# EAGLE design WisolWSSFM10R2-Breakout (EAGLE 8.1.1)
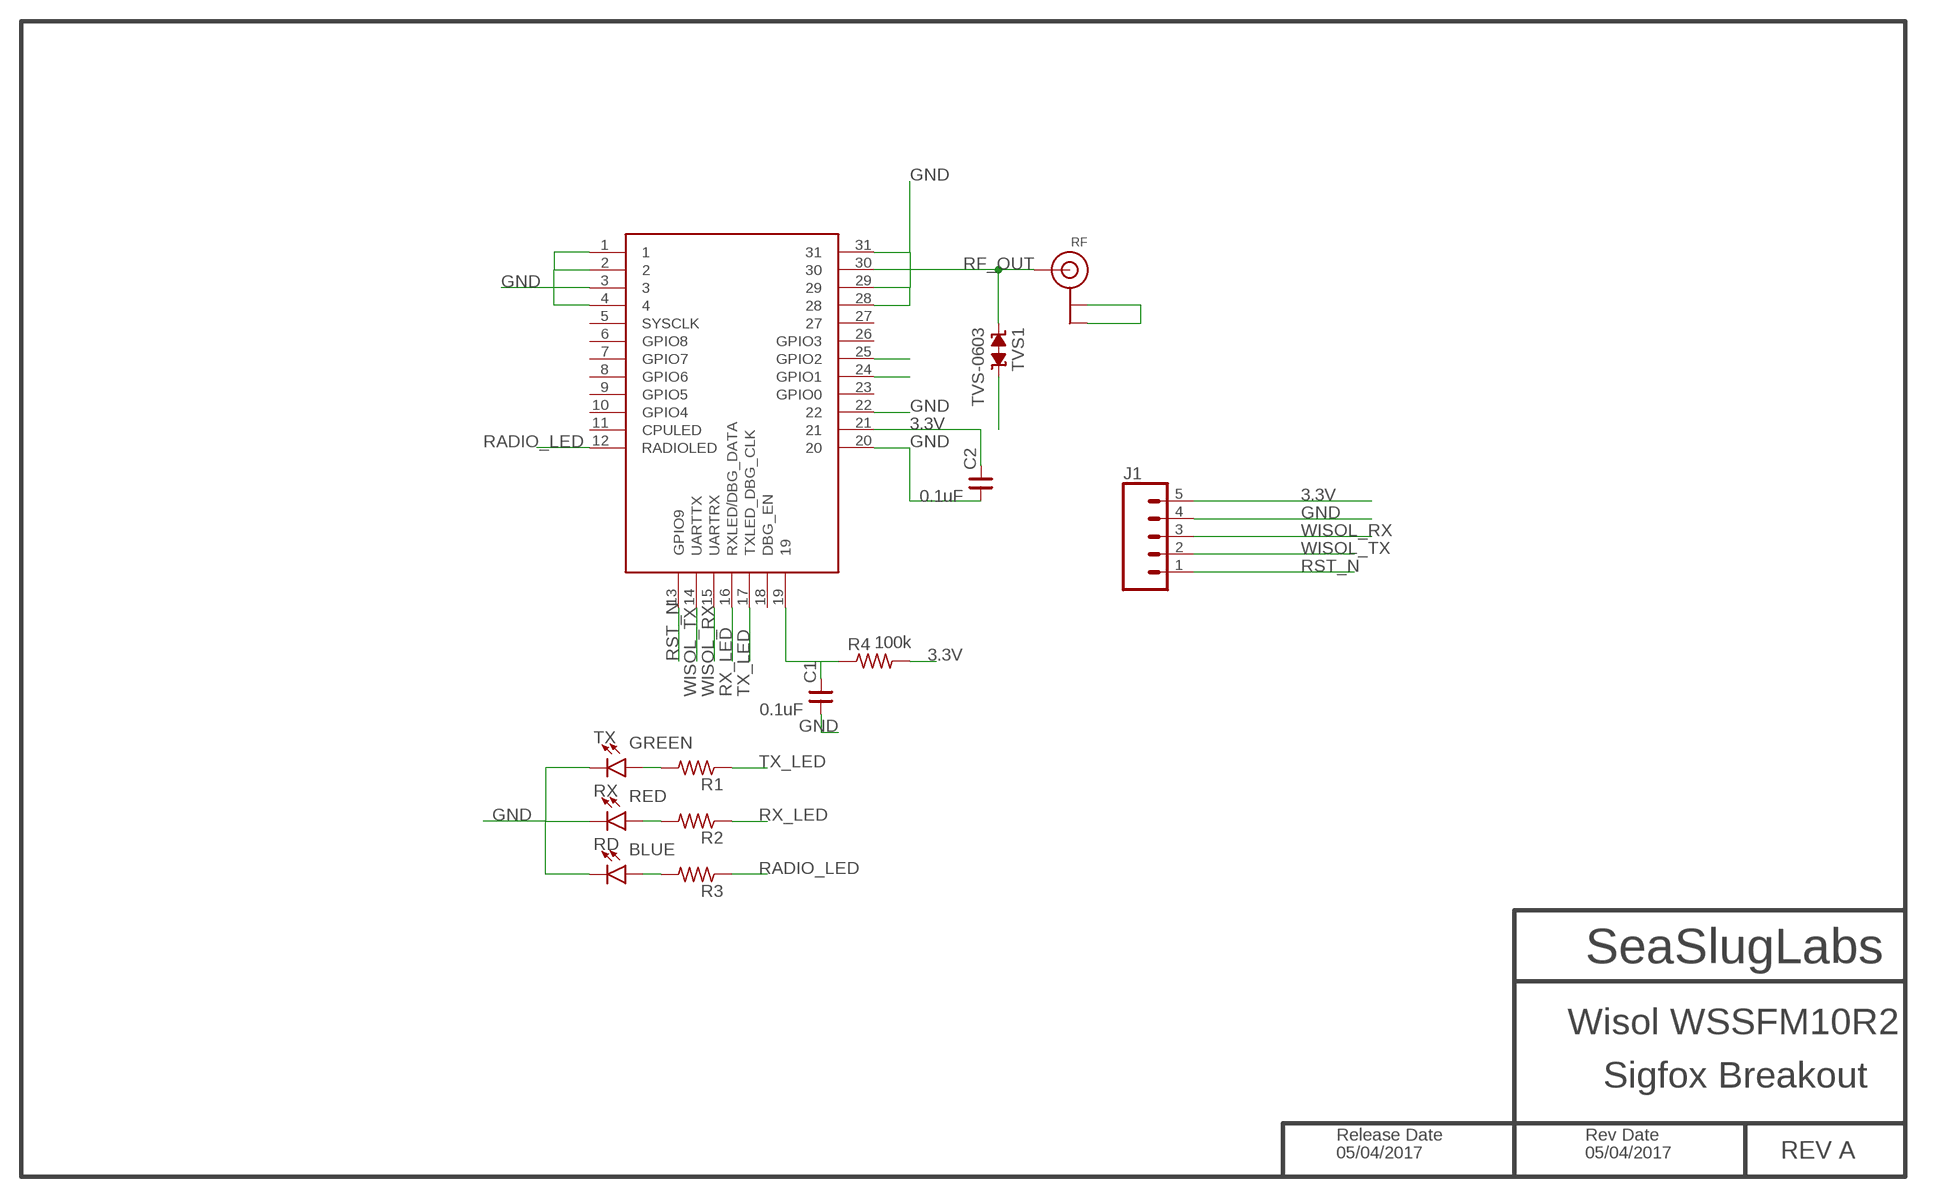
[diagram p0: schematic, sheet 1]

## Parts
C1  0.1uF  CNP-0402  [0402]
C2  0.1uF  CNP-0402  [0402]
J1  CONN_05  [1X05]
R1  R-US_R0402  [R0402]
R2  R-US_R0402  [R0402]
R3  R-US_R0402  [R0402]
R4  100k  R-US_R0402  [R0402]
RD  BLUE  LED-BLUE0603  [LED-0603]
RF  ANTENNA_U.FL  [U.FL]
RX  RED  LED-RED0603  [LED-0603]
TVS1  TVS-0603  [TVS0603]
TX  GREEN  LED-GREEN0603  [LED-0603]
WSSFM10R2  WSSFM10R2/R4WSSFM10R2R4  [WISOL]

## Nets
3.3V: C2.2 J1.5 R4.2 WSSFM10R2.21
GND: C1.1 C2.1 J1.4 RD.C RF.1(GND) RF.2(GND) RX.C TVS1.2 TX.C WSSFM10R2.1 WSSFM10R2.2 WSSFM10R2.3 WSSFM10R2.4 WSSFM10R2.20 WSSFM10R2.22 WSSFM10R2.28 WSSFM10R2.29 WSSFM10R2.31
GPIO1: WSSFM10R2.24(GPIO1)
GPIO2: WSSFM10R2.25(GPIO2)
N$1: C1.2 R4.1 WSSFM10R2.19
N$2: R1.2 TX.A
N$3: R2.2 RX.A
N$4: R3.2 RD.A
RADIO_LED: R3.1 WSSFM10R2.12(RADIOLED)
RF_OUT: RF.3(SIGNAL) TVS1.1 WSSFM10R2.30
RST_N: J1.1 WSSFM10R2.13(GPIO9)
RX_LED: R2.1 WSSFM10R2.16(RXLED/DBG_DATA)
TX_LED: R1.1 WSSFM10R2.17(TXLED_DBG_CLK)
WISOL_RX: J1.3 WSSFM10R2.15(UARTRX)
WISOL_TX: J1.2 WSSFM10R2.14(UARTTX)
Unconnected: WSSFM10R2.5(SYSCLK) WSSFM10R2.6(GPIO8) WSSFM10R2.7(GPIO7) WSSFM10R2.8(GPIO6) WSSFM10R2.9(GPIO5) WSSFM10R2.10(GPIO4) WSSFM10R2.11(CPULED) WSSFM10R2.18(DBG_EN) WSSFM10R2.23(GPIO0) WSSFM10R2.26(GPIO3) WSSFM10R2.27

## Notes on the sheet
- SeaSlugLabs
- Wisol WSSFM10R2
- Sigfox Breakout
- Release Date | Rev Date
- 05/04/2017 | 05/04/2017 | REV A

## Library data of the parts
C1 C2 = IoTthings:CNP-: NON-POLARIZED CAP
J1 = SparkFun-Connectors:CONN_05: Multi connection point. Often used as Generic Header-pin footprint for 0.1 inch spaced/style header connections On any of the 0.1 inch spaced packages, you can populate with these: Break Away Headers - Straight <https://www.sparkfun.com/products/116> (PRT-00116) Break Away Male Headers - Right Angle <https://www.sparkfun.com/products/553> (PRT-00553) Female Headers <https://www.sparkfun.com/products/115> (PRT-00115) Break Away Headers - Machine Pin <https://www.sparkfun.com/products/117> (PRT-00117) Break Away Female Headers - Swiss Machine Pin <https://www.sparkfun.com/products/743> (PRT-00743) For SCREWTERMINALS and SPRING TERMINALS visit here: Screw Terimnals on SparkFun.com <https://www.sparkfun.com/search/results?term=Screw+Terminals> (5mm/3.5mm/2.54mm spacing) This device is also useful as a general connection point to wire up your design to another part of your project. Our various solder wires solder well into these plated through hole pads. Hook-Up Wire - Assortment (Stranded, 22 AWG) <https://www.sparkfun.com/products/11375> (PRT-11375) Hook-Up Wire - Assortment (Solid Core, 22 AWG) <https://www.sparkfun.com/products/11367> (PRT-11367) View the entire wire category on our website here <https://www.sparkfun.com/categories/141> Special notes: Molex polarized connector foot print use with SKU : PRT-08231 with associated crimp pins and housings. 1MM SMD Version SKU: PRT-10208
R1-R4 = IoTthings:R-US_: RESISTOR, American symbol
RD = IoTthings:LED-BLUE: Blue SMD LED Used in manufacturing of various products at SparkFun Packages: 0603 - SMD 0603 package [Product Link] <http://www.digikey.com/product-detail/en/SMLE12BC7TT86/511-1589-2-ND/1641808> 1206 - SMD1206 package [Product Link] <http://www.digikey.com/product-detail/en/lite-on-inc/LTST-C150TBKT/160-1643-1-ND/573584> SparkFun Products: ESP8266 Thing-Dev Board <https://www.sparkfun.com/products/13711> RedBoard <https://www.sparkfun.com/products/12757>; PROD_ID: DIO-08575
RF = IoTthings:ANTENNA_U.FL: U.FL Antenna Connector
RX = IoTthings:LED-RED: Red SMD LED Used in manufacturing of most products at SparkFun Packages: 0603 - SMD 0603 package [Product Link] <http://docs.avagotech.com/docs/AV02-0551EN> 0603 SMART - SMD 0603 SMART package ( more efficient and expensive)[Product Link] <http://www.osram-os.com/Graphics/XPic2/00077099_0.pdf> 1206 - SMD1206 package [Product Link] <https://www.sparkfun.com/datasheets/DevTools/LilyPad/Q150OVS4.pdff> SparkFun Products: Pro Mini 328 -5V <https://www.sparkfun.com/products/821> RedBoard <https://www.sparkfun.com/products/12757> IOIO-OTG <https://www.sparkfun.com/products/13613>; PROD_ID: DIO-00819
TVS1 = supressor:TVS-: TVS BI-DIRECTIONAL
TX = IoTthings:LED-GREEN: Green SMD LED Used in manufacturing of various products at SparkFun Packages: 0603 - SMD 0603 package [Product Link] <http://www.futureelectronics.com/en/technologies/semiconductors/optoelectronics/leds/Pages/9894312-LTST-C190GKT.aspx?CrossPart=HSMG-C190&IM=0> LilyPad 1206 - SMD1206 LilyPad package [Product Link] <http://www.futureelectronics.com/en/Technologies/Product.aspx?ProductID=IN150NGHARVATEKCORPORATION2049943&IM=0> 1206 - SMD1206 package [Product Link] <http://www.futureelectronics.com/en/technologies/semiconductors/optoelectronics/leds/Pages/8315665-LTST-C150KGKT.aspx?IM=0> 1206 Bottom Mount -SMD 1206 Bottom Mount [Product Link] <http://www.digikey.com/product-detail/en/lite-on-inc/LTST-C230KGKT/160-1456-1-ND/386854> SparkFun Products: Pro Mini 328 -5V <https://www.sparkfun.com/products/821> RedBoard <https://www.sparkfun.com/products/12757> MP3 Trigger <https://www.sparkfun.com/products/13720> Makey Makey <https://www.sparkfun.com/products/11076>; PROD_ID: DIO-00821
WSSFM10R2 = SigfoxMod-RCZ1:WSSFM10R2/R4

## Board
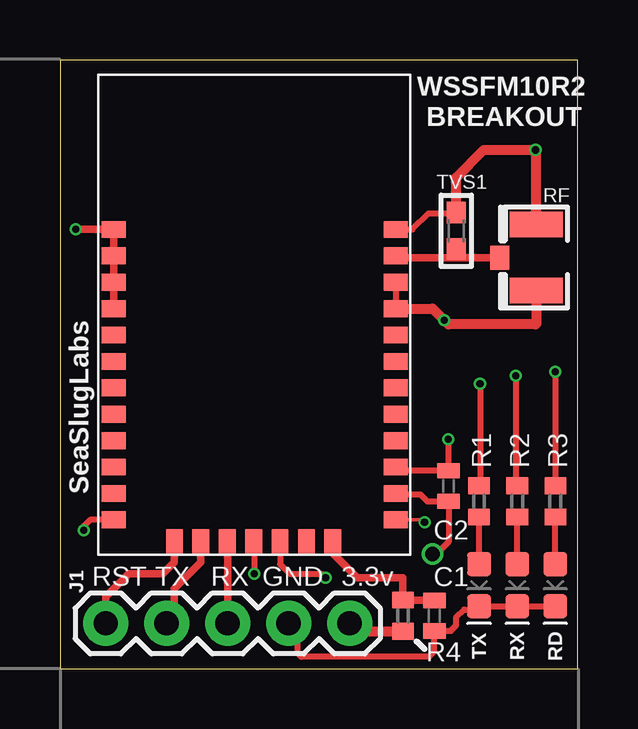
[diagram p1: board, top side]
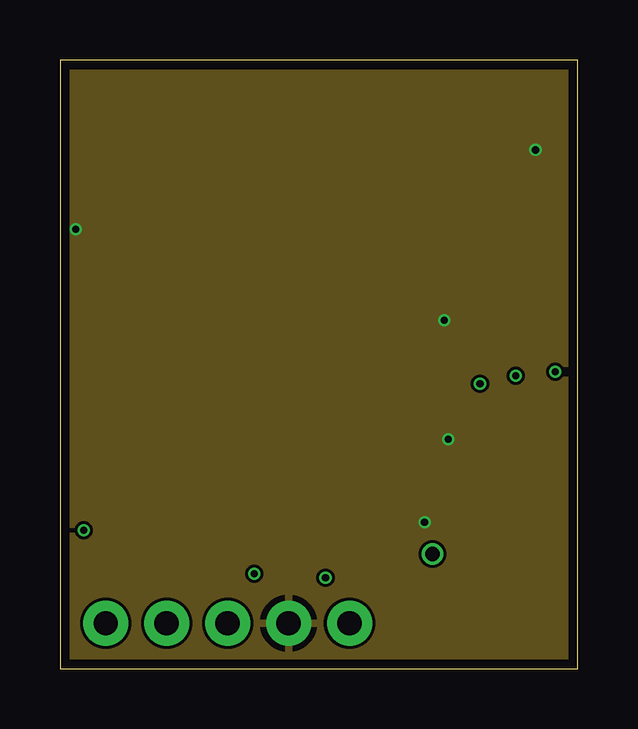
[diagram p2: board, inner layer Route2]
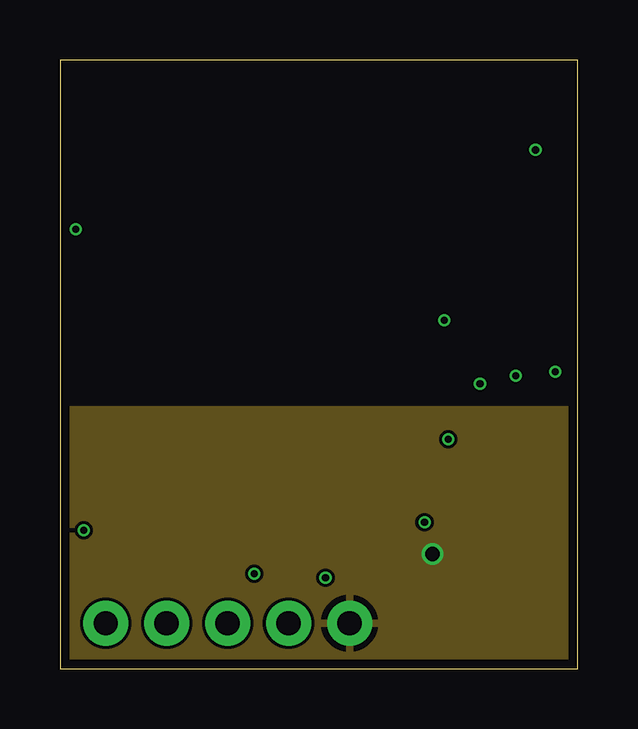
[diagram p3: board, inner layer Route15]
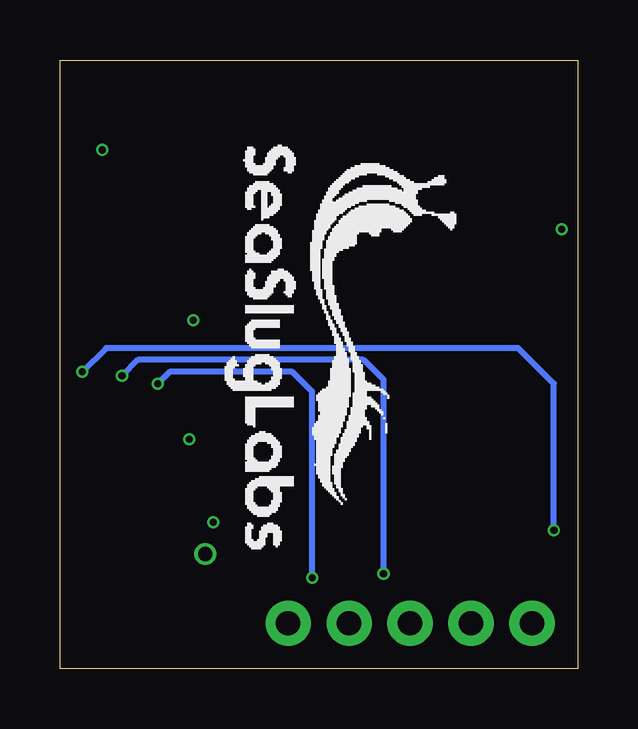
[diagram p4: board, bottom side, seen from below]

Size 21.57 x 25.37 mm. Coordinates in mm from the lower left corner, seen from the top.
Outline: 0,0 21.57,0 21.57,25.38 0,25.38 0,0
Copper layers (1*2*15*16): Top 0.035mm / dielectric 0.175mm / Route2 0.035mm / dielectric 1.13mm / Route15 0.035mm / dielectric 0.175mm / Bottom 0.035mm
Design rules "PCBway4layerStack": minimum track width 5mil, minimum drill 10mil, track to track 5mil, track to pad 5mil, pad to pad 5mil, via to via 5mil, smd to smd 5mil, copper to edge 15mil, drill to drill 6mil, minimum pad ring 4mil, minimum via ring 4mil, stop-mask expansion 2.5mil, vias tented up to drill 0mil, thermal gap 10mil
tRestrict: area 1.6,6.4 to 14.6,24.4

### Footprints (pad centres in the part's own frame; a part is rotated, then mirrored left to right if it is on the bottom)
0402 = smd 0.635 x 0.94: 1 -0.635,0; 2 0.635,0
1X05 = drill 1.016 pad 1.88: 1 0,0; 2 2.54,0; 3 5.08,0; 4 7.62,0; 5 10.16,0
R0402 = smd 0.7 x 0.9: 1 -0.65,0; 2 0.65,0
LED-0603 = smd 1 x 1: A -0.877,0; C 0.877,0
U.FL = smd 2.2 x 1.05: 1 0,1.375; 2 0,-1.375 | smd 0.8 x 1: 3 1.525,0
TVS0603 = smd 0.9 x 0.8: 1 -0.762,0; 2 0.762,0
WISOL = smd 1 x 0.7: 1 0.65,13.55; 2 0.65,12.45; 3 0.65,11.35; 4 0.65,10.25; 5 0.65,9.15; 6 0.65,8.05; 7 0.65,6.95; 8 0.65,5.85; 9 0.65,4.75; 10 0.65,3.65; 11 0.65,2.55; 12 0.65,1.45; 20 12.4,1.45; 21 12.4,2.55; 22 12.4,3.65; 23 12.4,4.75; 24 12.4,5.85; 25 12.4,6.95; 26 12.4,8.05; 27 12.4,9.15; 28 12.4,10.25; 29 12.4,11.35; 30 12.4,12.45; 31 12.4,13.55 | smd 0.7 x 1: 13 3.18,0.56; 14 4.28,0.56; 15 5.38,0.56; 16 6.48,0.56; 17 7.58,0.56; 18 8.68,0.56; 19 9.78,0.56

### Placement (x,y rotation side)
C1  15.6,2.22 90 top
C2  16.19,7.62 270 top
J1  1.91,1.91 0 top
R1  17.46,6.98 270 top
R2  19.05,6.98 270 top
R3  20.64,6.98 270 top
R4  14.29,2.22 270 top
RD  20.64,3.49 270 top
RF  19.84,17.15 180 top
RX  19.05,3.49 270 top
TVS1  16.51,18.26 90 top
TX  17.46,3.49 270 top
WSSFM10R2  1.59,4.76 0 top

### Tracks (layer width: path | path; a pad name or v marks a point on that pad's centre or on a via)
3.3V  (via drill 0.6)
  Top 0.254: WSSFM10R2.21 14.04,7.26 15.02,7.26 15.3,6.98 C2.2 16.19,5.3 15.85,4.95 15.68,4.95 v15.52,4.79
  Top 0.305: 12.4,1.57 J1.5
  Top 0.406: 12.4,1.57 R4.2
  pour Route15: 0,10.8 21.59,10.8 21.59,0 0,0
GND  (via drill 0.3)
  Top 0.152: WSSFM10R2.20 15.13,6.21 15.19,6.27 v15.19,6.11
  Top 0.254: J1.4 9.91,1.52 9.91,0.66 10.06,0.51 15.37,0.51 15.6,0.74 C1.1 16.28,1.59 16.51,1.82 16.51,2.15 16.84,2.48 17.32,2.48 TX.C RX.C RD.C | WSSFM10R2.31 14.68,18.31 15.35,18.99 16.48,18.99 TVS1.2 | WSSFM10R2.29 WSSFM10R2.28 | v16.01,14.53 15.85,14.69 | v19.81,21.63 19.84,21.6 | v16.18,9.58 16.18,9.41 16.19,9.4 C2.1 14.14,8.26 WSSFM10R2.22
  Top 0.305: WSSFM10R2.4 WSSFM10R2.3 WSSFM10R2.2 WSSFM10R2.1 0.84,18.31 0.83,18.33 v0.66,18.33
  Top 0.406: RF.2 19.84,21.6 | RF.1 19.84,14.4 19.81,14.36 16.18,14.36 v16.01,14.53 15.53,15.01 WSSFM10R2.28 | TVS1.2 16.51,20.47 17.67,21.63 v19.81,21.63
  pour Route2: 0,0 21.59,0 21.59,25.4 0,25.4
N$1
  Top 0.152: 11.56,5.13 WSSFM10R2.19
  Top 0.305: WSSFM10R2.19 11.37,4.83 12.38,3.81 14.29,3.81 R4.1 14.3,2.86 C1.2
N$2
  Top 0.254: TX.A R1.2
N$3
  Top 0.254: RX.A R2.2
N$4
  Top 0.254: RD.A R3.2
RADIO_LED  (via drill 0.3)
  Top 0.254: WSSFM10R2.12 1.26,6.21 0.99,5.94 v0.99,5.78 | v20.64,12.38 R3.1
  Bottom 0.254: v0.99,5.78 0.99,11.89 2.48,13.37 19.65,13.37 v20.64,12.38
RF_OUT
  Top 0.305: 16.68,17.15 RF.3 | 16.68,17.15 13.99,17.15 WSSFM10R2.30 | TVS1.1 16.68,17.33 16.68,17.15
RST_N
  Top 0.305: J1.1 1.91,3.02 2.86,3.97 4.29,3.97 4.76,4.45 WSSFM10R2.13
RX_LED  (via drill 0.3)
  Top 0.254: WSSFM10R2.16 8.09,5.32 v8.09,3.96 | v18.99,12.22 18.99,7.7 R2.1
  Bottom 0.254: v8.09,3.96 8.09,12.05 8.92,12.88 18.33,12.88 v18.99,12.22
TX_LED  (via drill 0.3)
  Top 0.254: WSSFM10R2.17 9.17,4.37 9.58,3.96 10.9,3.96 v11.06,3.8 | v17.5,11.89 17.5,7.67 R1.1
  Bottom 0.254: v11.06,3.8 11.06,11.56 11.89,12.38 17.01,12.38 v17.5,11.89
WISOL_RX
  Top 0.305: J1.3 6.99,5.3 WSSFM10R2.15
WISOL_TX
  Top 0.305: WSSFM10R2.14 5.87,4.44 4.76,3.33 4.76,2.22 J1.2

### Text on the board
tPlace: BREAKOUT | SeaSlugLabs | RST | TX | RX | GND | 3.3v